# EAGLE design Verteilerplatine MIRZ-MLL-CS-MS (EAGLE 9.6.2)
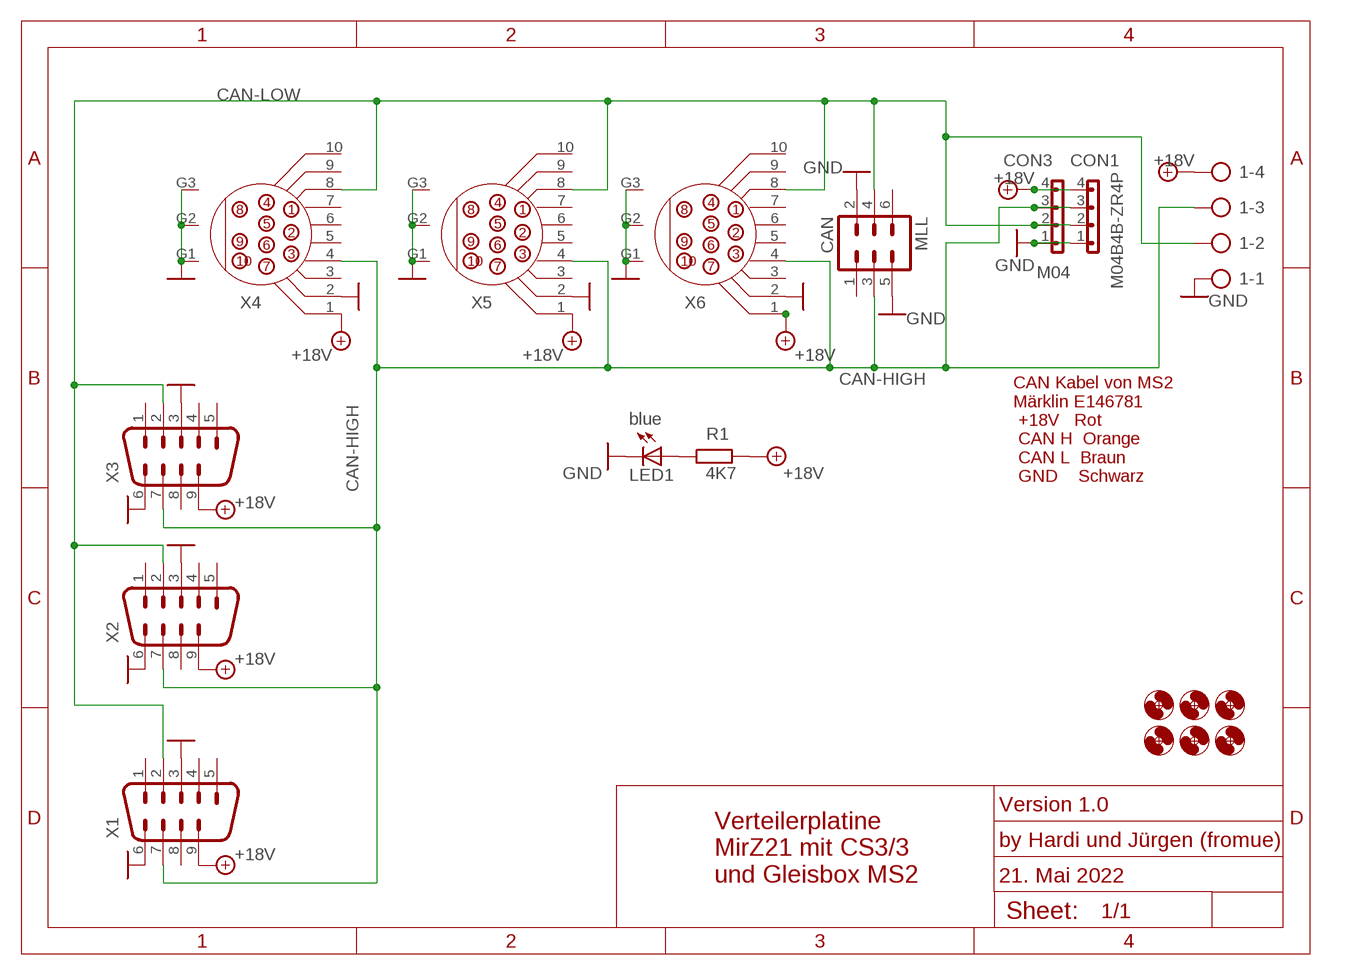
[diagram p0: schematic, sheet 1]

## Parts
1  CAN-LOW  AK500/4-H  [AK500/4-H]
CON1  M04B4B-ZR4P  [B4B-ZR4P]
CON3  M04  [1X04]
H1  MOUNT-HOLE3.0  [3,0]
H2  MOUNT-HOLE3.0  [3,0]
H3  MOUNT-HOLE3.0  [3,0]
H4  MOUNT-HOLE3.0  [3,0]
H5  MOUNT-HOLE3.0  [3,0]
H6  MOUNT-HOLE3.0  [3,0]
LED1  blue  LED3MM  [LED3MM]
MLL  CAN  ML6  [ML6]
R1  4K7  R0204/7  [0204/7]
X1  M09V  [M09V]
X2  M09V  [M09V]
X3  M09V  [M09V]
X4  MDSSV-BC10  [SSV-BC10]
X5  MDSSV-BC10  [SSV-BC10]
X6  MDSSV-BC10  [SSV-BC10]

## Nets
+18V: 1.4 CON1.4 CON3.4 R1.2 X1.9 X2.9 X3.9 X4.1 X5.1 X6.1
CAN-HIGH: 1.3 CON1.3 CON3.3 MLL.3 X1.7 X2.7 X3.7 X4.4 X5.4 X6.4
CAN-LOW: 1.2 CON1.2 CON3.2 MLL.4 X1.2 X2.2 X3.2 X4.8 X5.8 X6.8
GND: 1.1 CON1.1 CON3.1 LED1.K(C) MLL.2 MLL.5 X1.3 X1.6 X2.3 X2.6 X3.3 X3.6 X4.2 X4.G1(GND1) X4.G2(GND2) X4.G3(GND3) X5.2 X5.G1(GND1) X5.G2(GND2) X5.G3(GND3) X6.2 X6.G1(GND1) X6.G2(GND2) X6.G3(GND3)
N$1: LED1.A R1.1
Unconnected: MLL.1 MLL.6 X1.1 X1.4 X1.5 X1.8 X2.1 X2.4 X2.5 X2.8 X3.1 X3.4 X3.5 X3.8 X4.3 X4.5 X4.6 X4.7 X4.9 X4.10 X5.3 X5.5 X5.6 X5.7 X5.9 X5.10 X6.3 X6.5 X6.6 X6.7 X6.9 X6.10

## Notes on the sheet
- CAN Kabel von MS2
  Märklin E146781
   +18V   Rot
   CAN H  Orange    
   CAN L  Braun
   GND    Schwarz
- Version 1.0
- by Hardi und Jürgen (fromue)
- Verteilerplatine
  MirZ21 mit CS3/3
  und Gleisbox MS2
- 21. Mai 2022

## Library data of the parts
1 = con-ptr500:AK500/4-H: CONNECTOR Aug. 2004 / PTR Meßtechnik: Die Bezeichnung der Serie AK505 wurde geändert. Es handelt sich hierbei um AK500 in horizontaler Ausführung.; OC_FARNELL: unknown; OC_NEWARK: unknown
CON1 CON3 = Connectors_Inline3_7:M04
H1-H6 = holes:MOUNT-HOLE: MOUNTING HOLE with drill center marker
LED1 = Arduino_fuer_LEDs_DCC_2:LED: LED OSRAM: - CHIPLED LG R971, LG N971, LY N971, LG Q971, LY Q971, LO R971, LY R971 LH N974, LH R974 LS Q976, LO Q976, LY Q976 LO Q996 - Hyper CHIPLED LW Q18S LB Q993, LB Q99A, LB R99A - SideLED LS A670, LO A670, LY A670, LG A670, LP A670 LB A673, LV A673, LT A673, LW A673 LH A674 LY A675 LS A676, LA A676, LO A676, LY A676, LW A676 LS A679, LY A679, LG A679 - Hyper Micro SIDELED® LS Y876, LA Y876, LO Y876, LY Y876 LT Y87S - SmartLED LW L88C, LW L88S LB L89C, LB L89S, LG L890 LS L89K, LO L89K, LY L89K LS L896, LA L896, LO L896, LY L896 - TOPLED LS T670, LO T670, LY T670, LG T670, LP T670 LSG T670, LSP T670, LSY T670, LOP T670, LYG T670 LG T671, LOG T671, LSG T671 LB T673, LV T673, LT T673, LW T673 LH T674 LS T676, LA T676, LO T676, LY T676, LB T676, LH T676, LSB T676, LW T676 LB T67C, LV T67C, LT T67C, LS T67K, LO T67K, LY T67K, LW E67C LS E67B, LA E67B, LO E67B, LY E67B, LB E67C, LV E67C, LT E67C LW T67C LS T679, LY T679, LG T679 LS T770, LO T770, LY T770, LG T770, LP T770 LB T773, LV T773, LT T773, LW T773 LH T774 LS E675, LA E675, LY E675, LS T675 LS T776, LA T776, LO T776, LY T776, LB T776 LHGB T686 LT T68C, LB T68C - Hyper Mini TOPLED® LB M676 - Mini TOPLED Santana® LG M470 LS M47K, LO M47K, LY M47K Source: http://www.osram.convergy.de LUXEON: - LUMILED® LXK2-PW12-R00, LXK2-PW12-S00, LXK2-PW14-U00, LXK2-PW14-V00 LXK2-PM12-R00, LXK2-PM12-S00, LXK2-PM14-U00 LXK2-PE12-Q00, LXK2-PE12-R00, LXK2-PE12-S00, LXK2-PE14-T00, LXK2-PE14-U00 LXK2-PB12-K00, LXK2-PB12-L00, LXK2-PB12-M00, LXK2-PB14-N00, LXK2-PB14-P00, LXK2-PB14-Q00 LXK2-PR12-L00, LXK2-PR12-M00, LXK2-PR14-Q00, LXK2-PR14-R00 LXK2-PD12-Q00, LXK2-PD12-R00, LXK2-PD12-S00 LXK2-PH12-R00, LXK2-PH12-S00 LXK2-PL12-P00, LXK2-PL12-Q00, LXK2-PL12-R00 Source: www.luxeon.com KINGBRIGHT: KA-3528ASYC Source: www.kingbright.com
MLL = Arduino_fuer_LEDs_DCC_2:ML6: HARTING; OC_FARNELL: unknown; OC_NEWARK: unknown
R1 = Arduino_fuer_LEDs_DCC_2:R: RESISTOR, European symbol; SPICEMODEL: NONE; SPICEPREFIX: R
X1-X3 = con-subd:M09: SUB-D; OC_FARNELL: unknown; OC_NEWARK: unknown
X4-X6 = con-yamaichi:MDSSV-BC10: YAMAICHI CONNECTOR

## Board
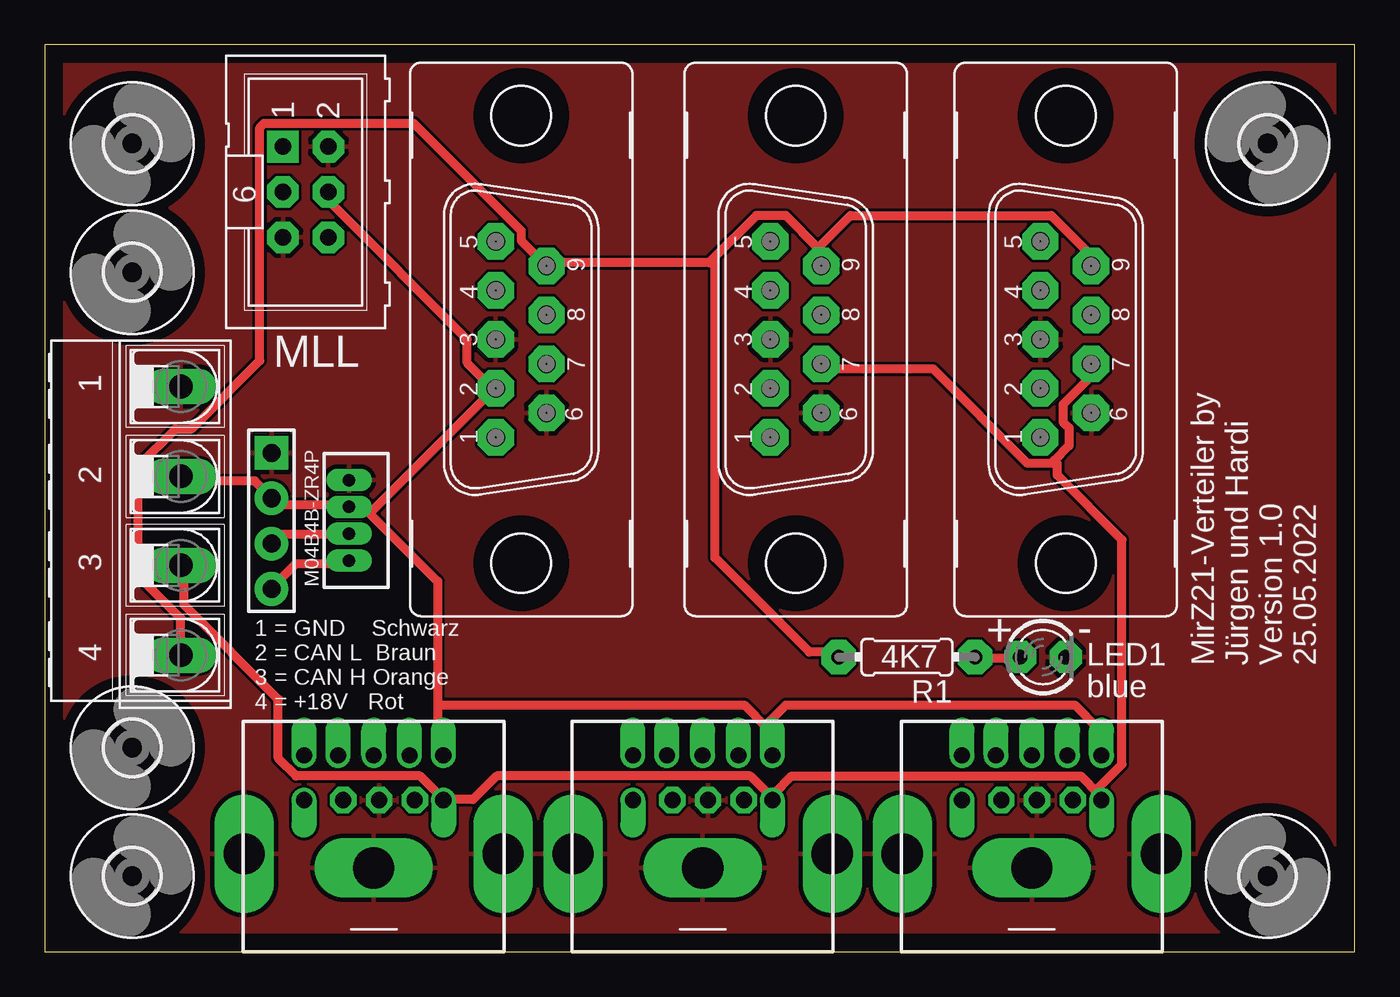
[diagram p1: board, top side]
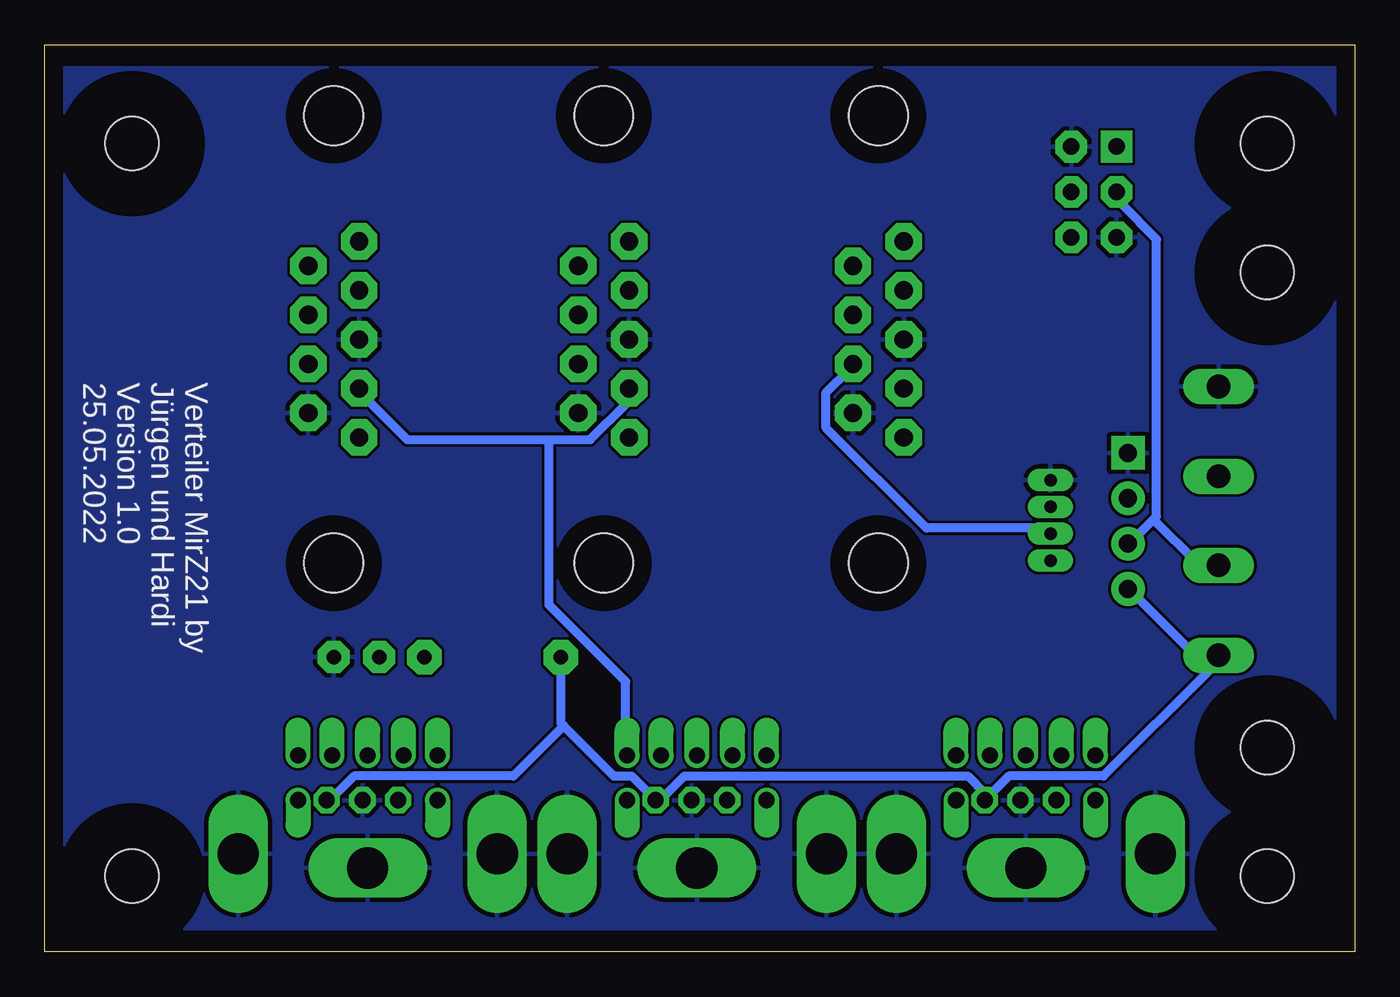
[diagram p2: board, bottom side, seen from below]

Size 73.33 x 50.79 mm. Coordinates in mm from the lower left corner, seen from the top.
Outline: 0,0 73.33,0 73.33,50.79 0,50.79 0,0
Copper layers (1*16): Top 0.035mm / dielectric 1.5mm / Bottom 0.035mm
Design rules "default *": minimum track width 20mil, minimum drill 0.35mm, track to track 6mil, track to pad 6mil, pad to pad 6mil, via to via 6mil, smd to smd 6mil, copper to edge 40mil, drill to drill 6mil, minimum pad ring 10mil, minimum via ring 8mil, stop-mask expansion 4mil, vias tented up to drill 0mil, thermal gap 10mil

### Footprints (pad centres in the part's own frame; a part is rotated, then mirrored left to right if it is on the bottom)
AK500/4-H = drill 1.321 long: 1 -7.518,0; 2 -2.489,0; 3 2.489,0; 4 7.518,0
B4B-ZR4P = drill 0.7 pad 1.27 long: 1 0,0; 2 1.5,0; 3 3,0; 4 4.5,0
1X04 = drill 1.016 pad 1.88 square: 1 0,0 | drill 1.016 pad 1.88: 2 2.54,0; 3 5.08,0; 4 7.62,0
3,0 = hole 3: 0,0
LED3MM = drill 0.813 pad 1.778 octagon: A -1.27,0; K 1.27,0
ML6 = drill 0.914 pad 1.778 square: 1 -2.54,-1.27 | drill 0.914 pad 1.778 octagon: 2 -2.54,1.27; 3 0,-1.27; 4 0,1.27; 5 2.54,-1.27; 6 2.54,1.27
0204/7 = drill 0.813 pad 1.93 octagon: 1 -3.81,0; 2 3.81,0
M09V = drill 1.016 pad 2.032 octagon: 1 -5.486,1.422; 2 -2.743,1.422; 3 0,1.422; 4 2.743,1.422; 5 5.486,1.422; 6 -4.115,-1.422; 7 -1.372,-1.422; 8 1.372,-1.422; 9 4.115,-1.422 | hole 3.302: -12.522,0; 12.522,0
SSV-BC10 = drill 0.9 pad 1.473 octagon: 1 -2.3,-8.5; 2 -0.3,-8.5; 3 1.7,-8.5 | drill 0.9 pad 1.27 offset: 4 -3.9,-8.5; 5 -2,-11; 6 0,-11; 7 3.9,-8.5; 8 -3.9,-11; 9 2,-11; 10 3.9,-11 | drill 2.3 pad 2.54 long: G1 -7.25,-5.5; G2 7.25,-5.5 | drill 2.3 pad 2.388 long: G3 0,-4.7

### Placement (x,y rotation side)
1  7.62,24.13 270 top
CON1  17.03,26.41 270 top
CON3  12.7,27.94 270 top
H1  68.44,45.25 90 top
H2  68.44,4.25 90 top
H3  4.9,45.25 0 top
H4  4.9,4.25 180 top
H5  4.9,11.43 0 top
H6  4.9,38.05 0 top
LED1  55.88,16.51 0 top
MLL  14.6,42.55 270 top
R1  48.26,16.51 180 top
X1  57.15,34.29 90 top
X2  42.04,34.29 90 top
X3  26.67,34.29 90 top
X4  18.41,0 180 top
X5  36.83,0 180 top
X6  55.24,0 180 top

### Tracks (layer width: path | path; a pad name or v marks a point on that pad's centre or on a via)
+18V
  Top 0.508: 37.35,38.75 39.83,41.22 41.48,41.22 43.29,39.41 | 37.35,38.75 37.19,38.58 28.27,38.58 X3.9 26.67,39.83 26.67,40.37 20.66,46.38 12.28,46.38 12.04,46.14 12.04,33.1 8.22,29.29 7.32,29.29 5.23,27.2 5.23,21.06 7.62,18.67 1.4 | 43.29,39.41 43.46,39.24 X2.9 | 43.29,39.41 45.11,41.22 56.34,41.22 58.32,39.24 58.32,38.58 X1.9 | CON1.4 16.71,21.74 14.07,21.74 12.75,20.42 CON3.4 | 37.35,38.75 37.52,38.58 37.52,22.07 42.8,16.79 44.45,16.79 R1.2
  Bottom 0.508: 8.13,15.8 7.47,16.46 1.4 8.13,15.8 | 8.13,15.8 14.07,9.85 19.35,9.85 20.68,8.53 X4.1 20.68,8.87 21.67,9.85 37.52,9.85 38.84,8.53 X5.1 39.17,8.53 40.49,9.85 41.48,9.85 44.29,12.66 | 8.13,15.8 12.42,20.09 CON3.4 | 44.29,12.66 44.45,12.83 R1.2 | 44.29,12.66 47.09,9.85 56.01,9.85 57.33,8.53 X6.1
CAN-HIGH
  Top 0.508: CON1.3 16.71,23.39 13.08,23.39 12.75,23.06 CON3.3 | 56.5,27.52 57.33,28.35 57.33,29.34 57,29.67 57,30.66 58.32,31.98 58.32,32.64 X1.7 | 56.5,27.52 56.34,27.36 55.02,27.36 49.73,32.64 43.46,32.64 X2.7 | 22.33,8.53 23.98,8.53 25.3,9.85 39.5,9.85 40.82,8.53 X5.4 40.82,8.87 41.81,9.85 57.99,9.85 58.98,8.87 58.98,8.53 X6.4 58.98,9.2 60.3,10.52 60.3,23.06 56.67,26.7 56.67,27.36 56.5,27.52 | 22.33,8.53 21.01,9.85 14.07,9.85 13.08,10.85 13.08,14.15 7.8,19.43 7.8,21.41 1.3 | 22.33,8.53 X4.4
  Bottom 0.508: 11.27,24.22 12.42,23.06 CON3.3 | 11.27,24.22 11.1,24.38 11.1,39.9 13.08,41.89 13.08,42.55 MLL.3 | 11.27,24.22 8.79,21.74 7.8,21.74 1.3 | X3.7 28.27,32.64 29.59,31.32 29.59,29.34 23.98,23.72 17.04,23.72 CON1.3
CAN-LOW
  Top 0.508: MLL.4 16.05,42.55 16.05,41.89 23.65,34.29 23.65,32.97 24.97,31.65 X3.2 24.97,31.32 18.2,24.55 | 22,13.82 22,20.75 18.2,24.55 | 22,13.82 22,11.18 X4.8 | 18.2,24.55 18.03,24.71 17.04,24.71 CON1.2 16.71,25.04 13.08,25.04 12.75,25.38 CON3.2 12.42,25.7 11.76,26.37 7.8,26.37 1.2 | 22,13.82 39.17,13.82 40.49,12.5 40.49,11.18 X5.8 40.49,12.83 41.48,13.82 57.66,13.82 58.98,12.5 58.98,11.18 X6.8
  Bottom 0.508: 45.11,28.68 53.04,28.68 55.68,31.32 X1.2 | 45.11,28.68 42.8,28.68 40.82,30.66 40.82,31.32 X2.2 | 45.11,28.68 45.11,19.43 40.82,15.14 40.82,11.18 X5.8
GND
  pour Top: 0,52.07 73.66,52.07 73.66,-1.27 0,-1.27
  pour Bottom: 0,49.53 73.66,49.53 73.66,1.27 0,1.27
N$1
  Top 0.508: LED1.A 54.36,16.46 52.37,16.46 R1.1

### Text on the board
tPlace: + | - | MirZ21-Verteiler by / Jürgen und Hardi / Version 1.0 / 25.05.2022 | 1 = GND Schwarz / 2 = CAN L Braun / 3 = CAN H Orange / 4 = +18V Rot
bPlace: Verteiler MirZ21 by / Jürgen und Hardi / Version 1.0 / 25.05.2022